# Altium project PCB__HMI3D.PrjPCB
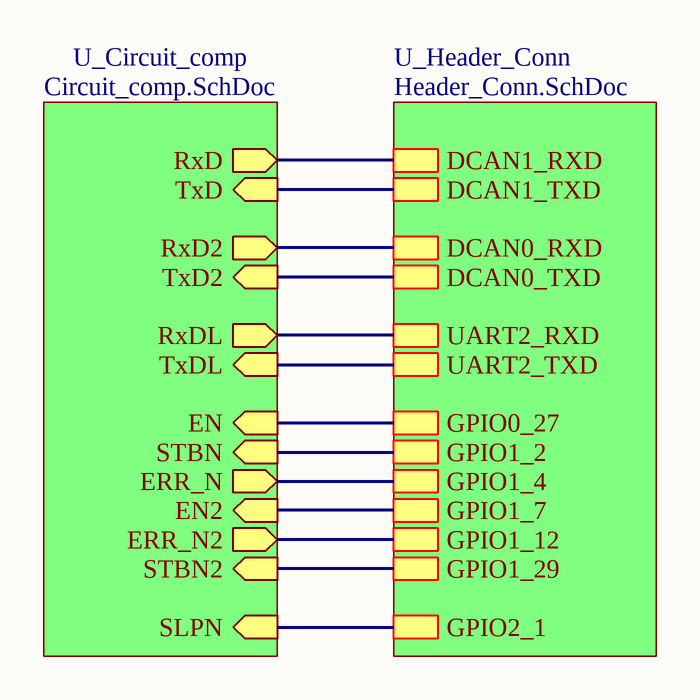
[diagram p0: Circuit.SchDoc]
7 sheets, 42 parts. Net scope: hierarchical (ports join the sheet entries above them; power ports are global).
Board file: Circuit.PcbDoc
Sheets:
  Circuit.SchDoc
    U_Circuit_comp = Circuit_comp.SchDoc
      U_Power_Sources = Power_Sources.SchDoc
        U_EMI_Prot_1 = EMI_Prot.SchDoc
        U_EMI_Prot_2 = EMI_Prot.SchDoc
      CAN2 = CAN2.SchDoc
        U_EMI_Prot_Circ = EMI_Prot_Circ.SchDoc
    U_Header_Conn = Header_Conn.SchDoc

## Sheet Circuit.SchDoc
size A4

### Sub-sheets
U_Circuit_comp = Circuit_comp.SchDoc: STBN2 (in), EN2 (in), TxD2 (in), ERR_N2 (out), RxD2 (out), RxDL (out), TxDL (in), SLPN (in), ERR_N (out), RxD (out), STBN (in), EN (in), TxD (in)
U_Header_Conn = Header_Conn.SchDoc: GPIO1_2, GPIO0_27, GPIO1_7, GPIO1_12, GPIO1_29, DCAN0_RXD, UART2_TXD, DCAN0_TXD, UART2_RXD, DCAN1_RXD, DCAN1_TXD, GPIO1_4, GPIO2_1

### Nets
GPIO0_27: sheet U_Circuit_comp/EN, sheet U_Header_Conn/GPIO0_27
GPIO1_12: sheet U_Circuit_comp/ERR_N2, sheet U_Header_Conn/GPIO1_12
GPIO1_29: sheet U_Circuit_comp/STBN2, sheet U_Header_Conn/GPIO1_29
GPIO2_1: sheet U_Circuit_comp/SLPN, sheet U_Header_Conn/GPIO2_1
I2C2_SCL: sheet U_Circuit_comp/RxD2, sheet U_Header_Conn/DCAN0_RXD
I2C2_SDA: sheet U_Circuit_comp/TxD2, sheet U_Header_Conn/DCAN0_TXD
MMC1_DAT2: sheet U_Circuit_comp/STBN, sheet U_Header_Conn/GPIO1_2
MMC1_DAT4: sheet U_Circuit_comp/ERR_N, sheet U_Header_Conn/GPIO1_4
MMC1_DAT7: sheet U_Circuit_comp/EN2, sheet U_Header_Conn/GPIO1_7
UART1_RXD: sheet U_Circuit_comp/TxD, sheet U_Header_Conn/DCAN1_TXD
UART1_TXD: sheet U_Circuit_comp/RxD, sheet U_Header_Conn/DCAN1_RXD
UART2_RXD: sheet U_Circuit_comp/RxDL, sheet U_Header_Conn/UART2_RXD
UART2_TXD: sheet U_Circuit_comp/TxDL, sheet U_Header_Conn/UART2_TXD

## Sheet Circuit_comp.SchDoc
size A4
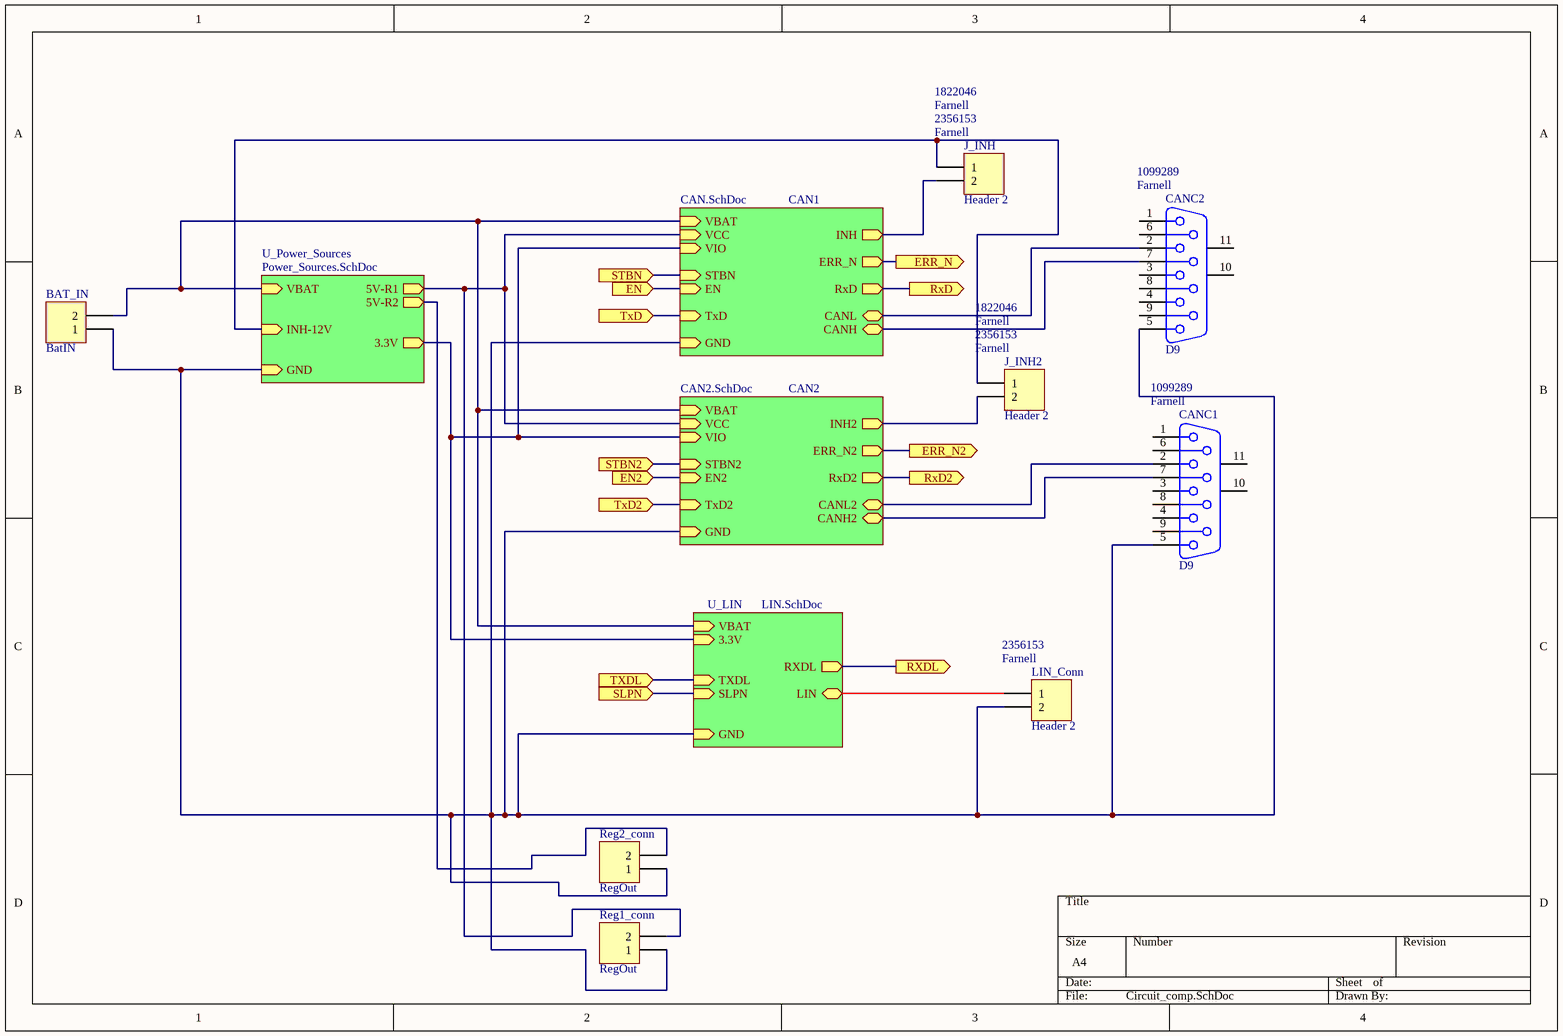
[diagram p1: Circuit_comp.SchDoc]

### Parts
BAT_IN  BatIN  [HDR1X2]
CANC1  D9  Supplier 1: Farnell  Supplier Part Number 1: 1099289  [DSUB1.385-2H9]
CANC2  D9  Supplier 1: Farnell  Supplier Part Number 1: 1099289  [DSUB1.385-2H9]
J_INH  Header 2  Supplier 1: Farnell  Supplier Part Number 1: 2356153  Supplier Part Number 2: 1822046  [HDR1X2]
J_INH2  Header 2  Supplier 1: Farnell  Supplier Part Number 1: 2356153  Supplier Part Number 2: 1822046  [HDR1X2]
LIN_Conn  Header 2  Supplier 1: Farnell  Supplier Part Number 1: 2356153  [HDR1X2]
Reg1_conn  RegOut  [HDR1X2]
Reg2_conn  RegOut  [HDR1X2]

### Sub-sheets
CAN1 = CAN.SchDoc (file not in this document): VCC (in), VIO (in), GND (in), INH (out), CANH (bidir), CANL (bidir), STBN (in), EN (in), ERR_N (out), TxD (in), RxD (out), VBAT (in)
CAN2 = CAN2.SchDoc: VCC (in), VIO (in), GND (in), INH2 (out), CANH2 (bidir), CANL2 (bidir), STBN2 (in), EN2 (in), ERR_N2 (out), TxD2 (in), RxD2 (out), VBAT (in)
U_LIN = LIN.SchDoc (file not in this document): VBAT (in), LIN (bidir), SLPN (in), RXDL (out), TXDL (in), GND (in), 3.3V (in)
U_Power_Sources = Power_Sources.SchDoc: VBAT (in), GND (in), INH-12V (in), 5V-R1 (out), 5V-R2 (out), 3.3V (out)

### Ports
EN2 (in), EN (in), ERR_N2 (out), ERR_N (out), RxD2 (out), RxD (out), RXDL (out), SLPN (in), STBN2 (in), STBN (in), TxD2 (in), TxD (in), TXDL (in)

### Nets
GND: BAT_IN.1 CANC1.5 CANC2.5 LIN_Conn.2 Reg1_conn.1 Reg2_conn.1 ; sheet CAN1/GND, sheet U_LIN/GND, sheet U_Power_Sources/GND, sheet CAN2/GND
GPIO0_27: port EN, sheet CAN1/EN
GPIO1_12: port ERR_N2, sheet CAN2/ERR_N2
GPIO1_29: port STBN2, sheet CAN2/STBN2
GPIO2_1: port SLPN, sheet U_LIN/SLPN
I2C2_SCL: port RxD2, sheet CAN2/RxD2
I2C2_SDA: port TxD2, sheet CAN2/TxD2
MMC1_DAT2: port STBN, sheet CAN1/STBN
MMC1_DAT4: port ERR_N, sheet CAN1/ERR_N
MMC1_DAT7: port EN2, sheet CAN2/EN2
UART1_RXD: port TxD, sheet CAN1/TxD
UART1_TXD: port RxD, sheet CAN1/RxD
UART2_RXD: port RXDL, sheet U_LIN/RXDL
UART2_TXD: port TXDL, sheet U_LIN/TXDL
NetBAT_IN_2: BAT_IN.2 ; sheet CAN1/VBAT, sheet U_LIN/VBAT, sheet U_Power_Sources/VBAT, sheet CAN2/VBAT
NetC22_2: Reg1_conn.2 ; sheet CAN1/VCC, sheet U_Power_Sources/5V-R1, sheet CAN2/VCC
NetC25_2: CANC1.7 ; sheet CAN2/CANH2
NetC26_2: CANC1.2 ; sheet CAN2/CANL2
NetC32_2: sheet CAN1/VIO, sheet U_LIN/3.3V, sheet U_Power_Sources/3.3V, sheet CAN2/VIO
NetCANC2_2: CANC2.2 ; sheet CAN1/CANL
NetCANC2_7: CANC2.7 ; sheet CAN1/CANH
NetJ_INH2_2: J_INH2.2 ; sheet CAN2/INH2
NetJ_INH_1: J_INH.1 J_INH2.1 ; sheet U_Power_Sources/INH-12V
NetJ_INH_2: J_INH.2 ; sheet CAN1/INH
NetLIN_Conn_1: LIN_Conn.1 ; sheet U_LIN/LIN
NetR34_1: Reg2_conn.2 ; sheet U_Power_Sources/5V-R2

Not connected (* = marked no-connect by the designer): CANC1 1 3 4 6 8 9 10(MH1) 11(MH2); CANC2 1 3 4 6 8 9 10(MH1) 11(MH2)

### Library data of the parts
BAT_IN J_INH J_INH2 LIN_Conn Reg1_conn Reg2_conn = Header 2: Header, 2-Pin; LatestRevisionDate: 17-Jul-2002; LatestRevisionNote: Re-released for DXP Platform.; Publisher: Altium Limited
  BAT_IN: Supplier Part Number 1: 612-0150; Supplier 1: RS
  J_INH J_INH2: Supplier 2: Farnell
CANC1 CANC2 = D Connector 9: Receptacle Assembly, 9 Position, Right Angle; PackageDocument: O; Positions: 9; Published: 15-Jun-2001; LatestRevisionDate: 17-Jul-2002; LatestRevisionNote: Re-released for DXP Platform.; DatasheetDocument: 1-Sep-1999; PackageReference: 788750; Publisher: Altium Limited; Orientation: Right Angle; Gender: Receptacle

## Sheet Power_Sources.SchDoc
size A4
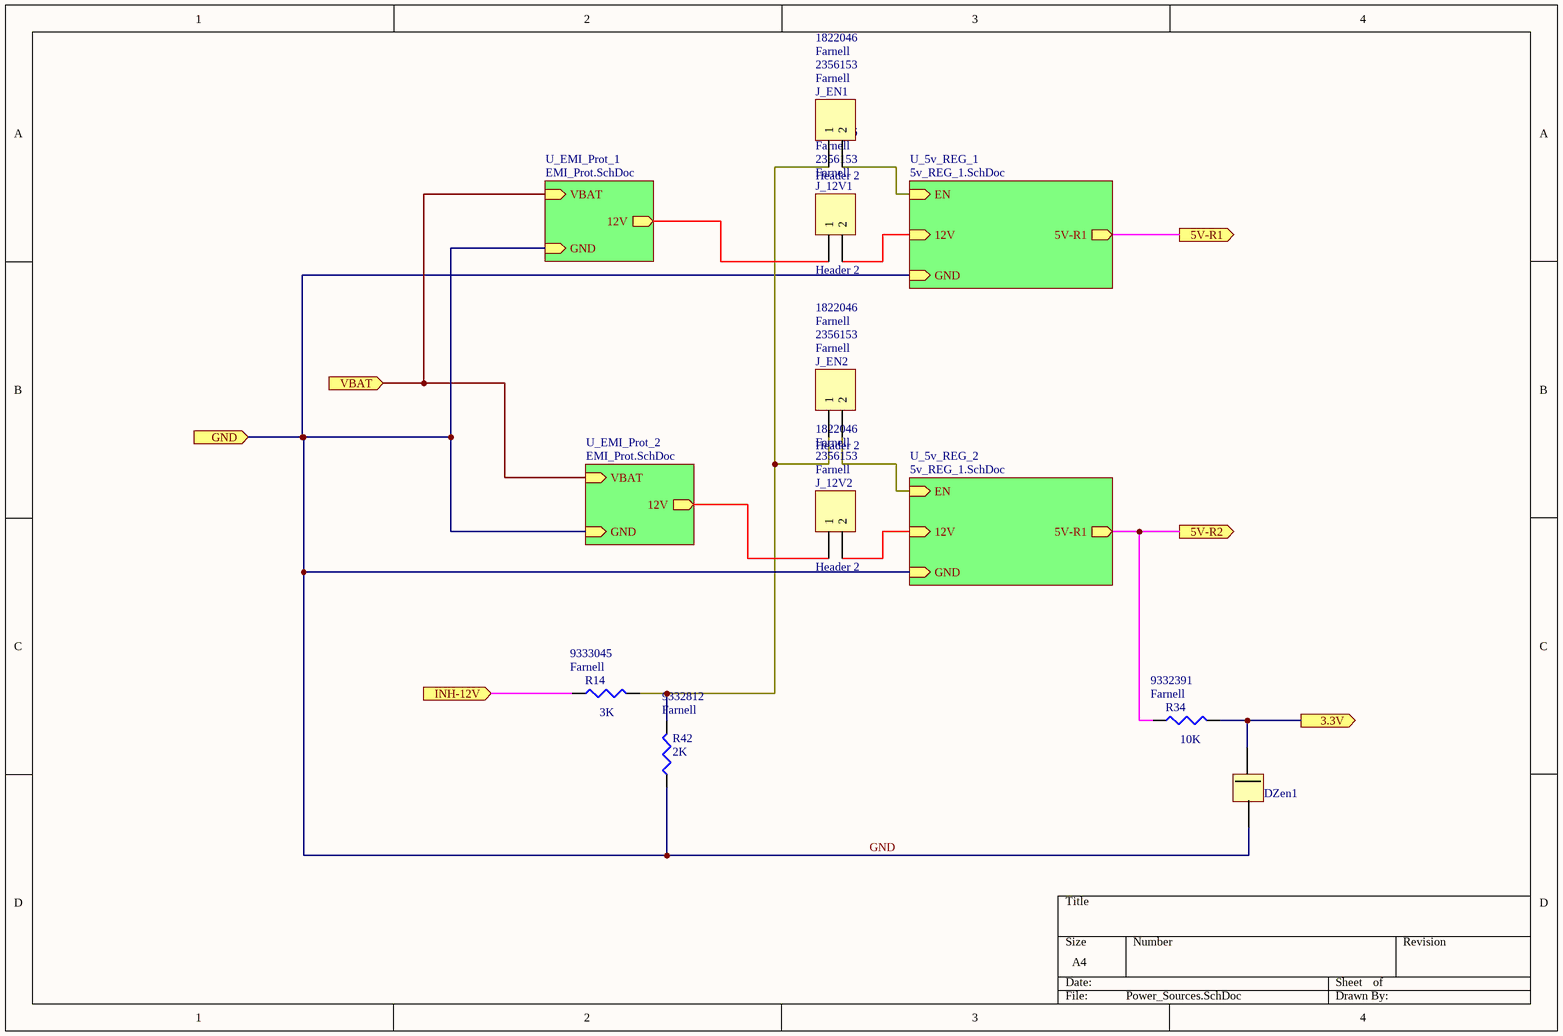
[diagram p2: Power_Sources.SchDoc]

### Parts
DZen1  3.3V  [Zener_Diode]  (value not drawn)
J_12V1  Header 2  Supplier 1: Farnell  Supplier Part Number 1: 2356153  Supplier Part Number 2: 1822046  [HDR1X2]
J_12V2  Header 2  Supplier 1: Farnell  Supplier Part Number 1: 2356153  Supplier Part Number 2: 1822046  [HDR1X2]
J_EN1  Header 2  Supplier 1: Farnell  Supplier Part Number 1: 2356153  Supplier Part Number 2: 1822046  [HDR1X2]
J_EN2  Header 2  Supplier 1: Farnell  Supplier Part Number 1: 2356153  Supplier Part Number 2: 1822046  [HDR1X2]
R14  Supplier 1: Farnell  Supplier Part Number 1: 9333045  [RES_0805]  (hidden comment: 3K)
R34  Supplier 1: Farnell  Supplier Part Number 1: 9332391  [RES_0805]  (hidden comment: 10K)
R42  Supplier 1: Farnell  Supplier Part Number 1: 9332812  [RES_0805]  (hidden comment: 2K)

### Sub-sheets
U_5v_REG_1 = 5v_REG_1.SchDoc (file not in this document): 12V (in), GND (in), EN (in), 5V-R1 (out)
U_5v_REG_2 = 5v_REG_1.SchDoc (file not in this document): 12V (in), GND (in), EN (in), 5V-R1 (out)
U_EMI_Prot_1 = EMI_Prot.SchDoc: VBAT (in), GND (in), 12V (out)
U_EMI_Prot_2 = EMI_Prot.SchDoc: VBAT (in), GND (in), 12V (out)

### Ports
3.3V (out), 5V-R1 (out), 5V-R2 (out), GND (in), INH-12V (in), VBAT (in)

### Nets
GND: DZen1.D2 R42.1 ; port GND, sheet U_5v_REG_1/GND, sheet U_5v_REG_2/GND, sheet U_EMI_Prot_1/GND, sheet U_EMI_Prot_2/GND
NetBAT_IN_2: port VBAT, sheet U_EMI_Prot_1/VBAT, sheet U_EMI_Prot_2/VBAT
NetC22_2: port 5V-R1, sheet U_5v_REG_1/5V-R1
NetC32_2: DZen1.D1 R34.2 ; port 3.3V
NetJ_12V1_1: J_12V1.1 ; sheet U_EMI_Prot_1/12V
NetJ_12V1_2: J_12V1.2 ; sheet U_5v_REG_1/12V
NetJ_12V2_1: J_12V2.1 ; sheet U_EMI_Prot_2/12V
NetJ_12V2_2: J_12V2.2 ; sheet U_5v_REG_2/12V
NetJ_EN1_1: J_EN1.1 J_EN2.1 R14.2 R42.2
NetJ_EN1_2: J_EN1.2 ; sheet U_5v_REG_1/EN
NetJ_EN2_2: J_EN2.2 ; sheet U_5v_REG_2/EN
NetJ_INH_1: R14.1 ; port INH-12V
NetR34_1: R34.1 ; port 5V-R2, sheet U_5v_REG_2/5V-R1

### Library data of the parts
DZen1 = D_Zener: Zener Diode 3.3V; Supplier Part Number 1: 621-BZT52HC3V3WF-7; Supplier 1: Mouser; HelpURL: http://www.mouser.com/ds/2/115/BZT52HC2V4WF%20-%20BZT52HC47WF-948206.pdf
J_12V1 J_12V2 J_EN1 J_EN2 = Header 2: Header, 2-Pin; LatestRevisionDate: 17-Jul-2002; LatestRevisionNote: Re-released for DXP Platform.; Publisher: Altium Limited; Supplier 2: Farnell
R14 R34 R42 = Res3: Resistor; Published: 8-Jun-2000; LatestRevisionDate: 29-May-2009; LatestRevisionNote: IPC-7351 Footprint Added.; PackageReference: J1-0603; Publisher: Altium Limited; PackageDescription: Chip Resistor
  R14: Value: 3K
  R34: Value: 10K
  R42: Value: 2K

## Sheet EMI_Prot.SchDoc
size A4
Used 2 times, as channels U_Circuit_comp/U_Power_Sources/U_EMI_Prot_1, U_Circuit_comp/U_Power_Sources/U_EMI_Prot_2. Parts and nets are listed once, with the designators drawn on the sheet.
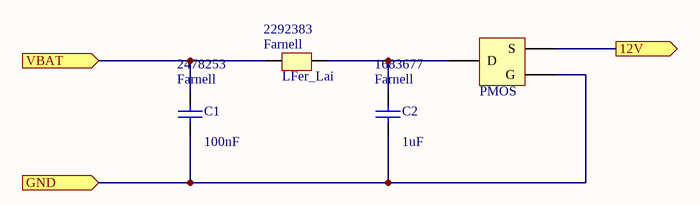
[diagram p3: EMI_Prot.SchDoc]

### Parts
C1  value 100nF  Supplier 1: Farnell  Supplier Part Number 1: 2478253  [CAP_0805]  (hidden comment: 100n)
C2  value 1uF  Supplier 1: Farnell  Supplier Part Number 1: 1683677  [CAP_0805]  (hidden comment: 1u)
LFer_Lai  Supplier 1: Farnell  Supplier Part Number 1: 2292383  [LFerrite_Laird]
PMOS  (no value)  [PMOS]

### Ports
12V (out), GND (in), VBAT (in)

### Nets
12V: PMOS.S ; port 12V
GND: C1.2 C2.2 PMOS.G ; port GND
VBAT: C1.1 LFer_Lai.1 ; port VBAT
NetC2_1: C2.1 LFer_Lai.2 PMOS.D

### Channels
U_Circuit_comp/U_Power_Sources/U_EMI_Prot_1: designators C1=C1#1 C2=C2#1 LFer_Lai=LFer_L#1 PMOS=PMOS#1; ports 12V=NetJ_12V1_1 GND=GND VBAT=NetBAT_IN_2
U_Circuit_comp/U_Power_Sources/U_EMI_Prot_2: designators C1=C1#2 C2=C2#2 LFer_Lai=LFer_L#2 PMOS=PMOS#2; ports 12V=NetJ_12V2_1 GND=GND VBAT=NetBAT_IN_2

### Library data of the parts
C1 C2 = Cap Semi: Capacitor; Published: 8-Jun-2000; LatestRevisionDate: 29-May-2009; LatestRevisionNote: IPC-7351 Footprint Added.; PackageReference: C1206; Publisher: Altium Limited; PackageDescription: Chip Capacitor
LFer_Lai = LFerrite_Laird: Laird ferrite chip bead; HelpURL: http://www.farnell.com/datasheets/1685731.pdf?_ga=1.185171822.65109063.1469090403
PMOS = PMOS: P channel Mosfet; HelpURL: http://www.mouser.com/ds/2/115/DMP6180SK3-247239.pdf

## Sheet CAN2.SchDoc
size A4
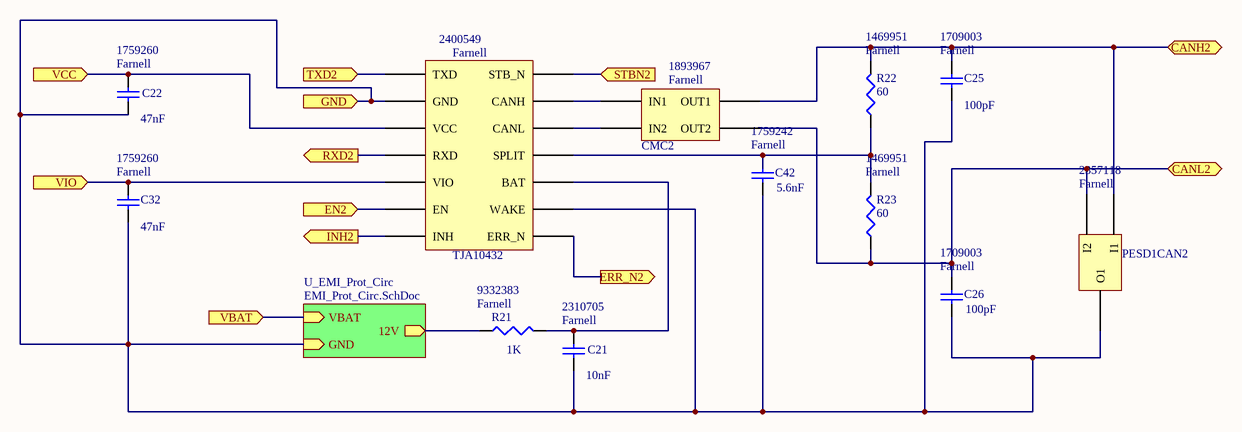
[diagram p4: CAN2.SchDoc]

### Parts
C21  value 10nF  Supplier 1: Farnell  Supplier Part Number 1: 2310705  [CAP_0805]  (hidden comment: 10n)
C22  value 47nF  Supplier 1: Farnell  Supplier Part Number 1: 1759260  [CAP_0805]  (hidden comment: 47n)
C25  value 100pF  Supplier 1: Farnell  Supplier Part Number 1: 1709003  [CAP_0805]  (hidden comment: 100p)
C26  value 100pF  Supplier 1: Farnell  Supplier Part Number 1: 1709003  [CAP_0805]  (hidden comment: 100p)
C32  value 47nF  Supplier 1: Farnell  Supplier Part Number 1: 1759260  [CAP_0805]  (hidden comment: 47n)
C42  value 5.6nF  Supplier 1: Farnell  Supplier Part Number 1: 1759242  [CAP_0805]  (hidden comment: 5.6n)
CMC2  Supplier 1: Farnell  Supplier Part Number 1: 1893967  [CMC]
PESD1CAN2  Supplier 1: Farnell  Supplier Part Number 1: 2357118  [SOT32-PESD1CAN]
R21  Supplier 1: Farnell  Supplier Part Number 1: 9332383  [RES_0805]  (hidden comment: 1k)
R22  Supplier 1: Farnell  Supplier Part Number 1: 1469951  [RES_0805]  (hidden comment: 60)
R23  Supplier 1: Farnell  Supplier Part Number 1: 1469951  [RES_0805]  (hidden comment: 60)
TJA10432  Supplier 1: Farnell  Supplier Part Number 1: 2400549  [SOIC14-TJA1043]

### Sub-sheets
U_EMI_Prot_Circ = EMI_Prot_Circ.SchDoc: VBAT (in), GND (in), 12V (out)

### Ports
CANH2 (bidir), CANL2 (bidir), EN2 (in), ERR_N2 (out), GND (in), INH2 (out), RXD2 (out), STBN2 (in), TXD2 (in), VBAT (in), VCC (in), VIO (in)

### Nets
GND: C21.1 C22.1 C25.1 C26.1 C32.1 C42.1 PESD1CAN2.O1 TJA10432.GND TJA10432.WAKE ; port GND, sheet U_EMI_Prot_Circ/GND
GPIO1_12: TJA10432.ERR_N ; port ERR_N2
GPIO1_29: TJA10432.STB_N ; port STBN2
I2C2_SCL: TJA10432.RXD ; port RXD2
I2C2_SDA: TJA10432.TXD ; port TXD2
MMC1_DAT7: TJA10432.EN ; port EN2
NetBAT_IN_2: port VBAT, sheet U_EMI_Prot_Circ/VBAT
NetC21_2: C21.2 R21.2 TJA10432.BAT
NetC22_2: C22.2 TJA10432.VCC ; port VCC
NetC25_2: C25.2 CMC2.OUT1 PESD1CAN2.I1 R22.2 ; port CANH2
NetC26_2: C26.2 CMC2.OUT2 PESD1CAN2.I2 R23.1 ; port CANL2
NetC32_2: C32.2 TJA10432.VIO ; port VIO
NetC42_2: C42.2 R22.1 R23.2 TJA10432.SPLIT
NetCMC2_IN1: CMC2.IN1 TJA10432.CANH
NetCMC2_IN2: CMC2.IN2 TJA10432.CANL
NetJ_INH2_2: TJA10432.INH ; port INH2
NetPMOS#3_S: R21.1 ; sheet U_EMI_Prot_Circ/12V

### Library data of the parts
C21 C22 C25 C26 C32 C42 = Cap Semi: Capacitor; Published: 8-Jun-2000; LatestRevisionDate: 29-May-2009; LatestRevisionNote: IPC-7351 Footprint Added.; PackageReference: C1206; Publisher: Altium Limited; PackageDescription: Chip Capacitor
CMC2 = Common_Mode_Choke: Common mode choke: DR331-475BE; HelpURL: http://www.mouser.com/ds/2/54/R331-777616.pdf
PESD1CAN2 = PESD1CAN: CAN bus ESD protection diode
R21-R23 = Res3: Resistor; Published: 8-Jun-2000; LatestRevisionDate: 29-May-2009; LatestRevisionNote: IPC-7351 Footprint Added.; PackageReference: J1-0603; Publisher: Altium Limited; PackageDescription: Chip Resistor
  R21: Value: 1K
  R22 R23: Value: 60
TJA10432 = TJA1043: CAN transceiver; Models: TJA10432; HelpURL: http://www.nxp.com/documents/data_sheet/TJA1043.pdf

## Sheet EMI_Prot_Circ.SchDoc
size A4
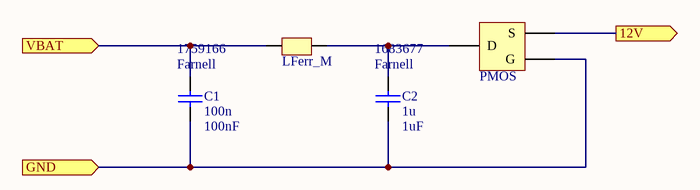
[diagram p5: EMI_Prot_Circ.SchDoc]

### Parts
(Parts that share a designator on the sheet are numbered #1, #2 ... from top to bottom, then left to right.)
C1#3  100n  value 100nF  Supplier 1: Farnell  Supplier Part Number 1: 1759166  [CAP_0805]
C2#3  1u  value 1uF  Supplier 1: Farnell  Supplier Part Number 1: 1683677  [CAP_0805]
LFerr_M  (no value)  [LFERRITE_MURATA_BLM21A]
PMOS#3  (no value)  [PMOS]

### Ports
12V (out), GND (in), VBAT (in)

### Nets
GND: C1#3.2 C2#3.2 PMOS#3.G ; port GND
NetBAT_IN_2: C1#3.1 LFerr_M.1 ; port VBAT
NetC2#3_1: C2#3.1 LFerr_M.2 PMOS#3.D
NetPMOS#3_S: PMOS#3.S ; port 12V

### Library data of the parts
C1#3 C2#3 = Cap Semi: Capacitor; Published: 8-Jun-2000; LatestRevisionDate: 29-May-2009; LatestRevisionNote: IPC-7351 Footprint Added.; PackageReference: C1206; Publisher: Altium Limited; PackageDescription: Chip Capacitor
LFerr_M = LFerrite_Murata: Murata ferrite chip bead - BLE32PN300SN1L; Impedance: 30ohm; MAX DC CUR: 10A; HelpURL: http://www.mouser.com/ds/2/281/c31e-522703.pdf; Supplier Part Number 1: 81-BLE32PN300SN1L; Supplier 1: Mouser
PMOS#3 = PMOS: P channel Mosfet; HelpURL: http://www.mouser.com/ds/2/115/DMP6180SK3-247239.pdf; Supplier 1: Mouser; Supplier Part Number 1: 621-DMP6180SK3-13

## Sheet Header_Conn.SchDoc
size A4
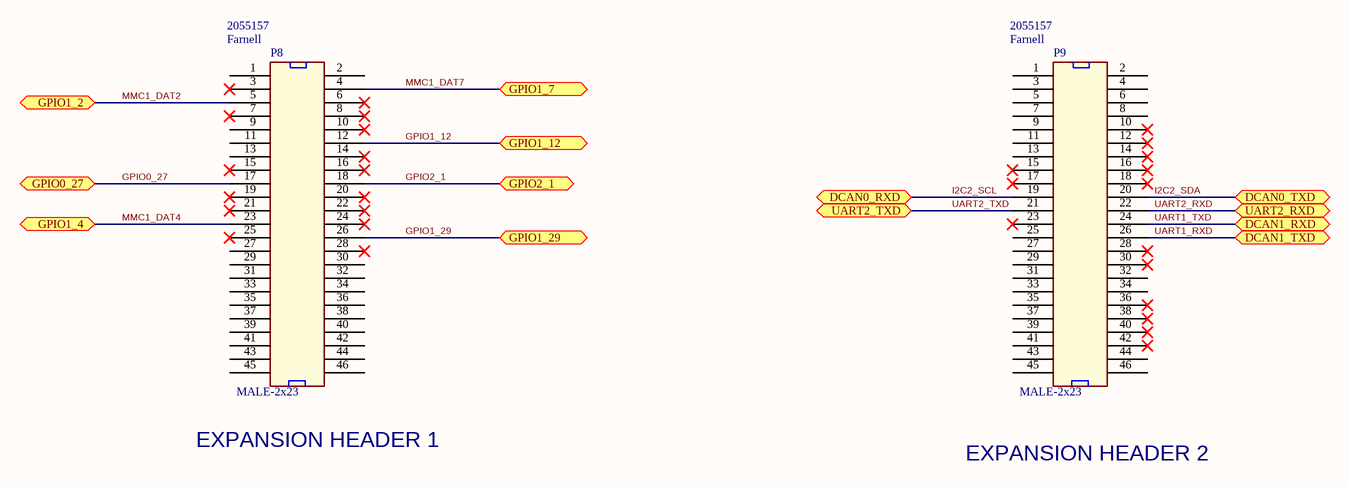
[diagram p6: Header_Conn.SchDoc]

### Parts
P8  MALE-2x23  Supplier 1: Farnell  Supplier Part Number 1: 2055157  [Beagle_Header]
P9  MALE-2x23  Supplier 1: Farnell  Supplier Part Number 1: 2055157  [Beagle_Header]

### Ports
DCAN0_RXD, DCAN0_TXD, DCAN1_RXD, DCAN1_TXD, GPIO0_27, GPIO1_2, GPIO1_4, GPIO1_7, GPIO1_12, GPIO1_29, GPIO2_1, UART2_RXD, UART2_TXD

### Nets
GPIO0_27: P8.17 ; port GPIO0_27
GPIO1_12: P8.12 ; port GPIO1_12
GPIO1_29: P8.26 ; port GPIO1_29
GPIO2_1: P8.18 ; port GPIO2_1
I2C2_SCL: P9.19 ; port DCAN0_RXD
I2C2_SDA: P9.20 ; port DCAN0_TXD
MMC1_DAT2: P8.5 ; port GPIO1_2
MMC1_DAT4: P8.23 ; port GPIO1_4
MMC1_DAT7: P8.4 ; port GPIO1_7
UART1_RXD: P9.26 ; port DCAN1_TXD
UART1_TXD: P9.24 ; port DCAN1_RXD
UART2_RXD: P9.22 ; port UART2_RXD
UART2_TXD: P9.21 ; port UART2_TXD

Not connected (* = marked no-connect by the designer): P8 1 2(26) 3(2)* 6(28)* 7(4)* 8(29)* 9(5) 10(30)* 11(6) 13(7) 14(32)* 15(8)* 16(33)* 19(10)* 20(35)* 21(11)* 22(36)* 24(37)* 25(13)* 27(14) 28(39)* 29(15) 30(40) 31(16) 32(41) 33(17) 34(42) 35(18) 36(43) 37(19) 38(44) 39(20) 40(45) 41(21) 42(46) 43(22) 44(47) 45(23) 46(48); P9 1 2(26) 3(2) 4(27) 5(3) 6(28) 7(4) 8(29) 9(5) 10(30)* 11(6) 12(31)* 13(7) 14(32)* 15(8)* 16(33)* 17(9)* 18(34)* 23(12)* 25(13) 27(14) 28(39)* 29(15) 30(40)* 31(16) 32(41) 33(17) 34(42) 35(18) 36(43)* 37(19) 38(44)* 39(20) 40(45)* 41(21) 42(46)* 43(22) 44(47) 45(23) 46(48)

### Notes on the sheet
- EXPANSION HEADER 1
- EXPANSION HEADER 2

### Library data of the parts
P8 P9 = BHead: MALE HEADER 2x23

## Nets that join several sheets
GND: Circuit_comp (6 pins), Power_Sources (DZen1.D2 R42.1), U_Circuit_comp/U_Power_Sources/U_EMI_Prot_1 (C1#1.2 C2#1.2 PMOS#1.G), U_Circuit_comp/U_Power_Sources/U_EMI_Prot_2 (C1#2.2 C2#2.2 PMOS#2.G), CAN2 (9 pins), EMI_Prot_Circ (C1#3.2 C2#3.2 PMOS#3.G)
GPIO1_12: CAN2 (TJA10432.ERR_N), Header_Conn (P8.12)
GPIO1_29: CAN2 (TJA10432.STB_N), Header_Conn (P8.26)
I2C2_SCL: CAN2 (TJA10432.RXD), Header_Conn (P9.19)
I2C2_SDA: CAN2 (TJA10432.TXD), Header_Conn (P9.20)
MMC1_DAT7: CAN2 (TJA10432.EN), Header_Conn (P8.4)
NetBAT_IN_2: Circuit_comp (BAT_IN.2), U_Circuit_comp/U_Power_Sources/U_EMI_Prot_1 (C1#1.1 LFer_L#1.1), U_Circuit_comp/U_Power_Sources/U_EMI_Prot_2 (C1#2.1 LFer_L#2.1), EMI_Prot_Circ (C1#3.1 LFerr_M.1)
NetC22_2: Circuit_comp (Reg1_conn.2), CAN2 (C22.2 TJA10432.VCC)
NetC25_2: Circuit_comp (CANC1.7), CAN2 (C25.2 CMC2.OUT1 PESD1CAN2.I1 R22.2)
NetC26_2: Circuit_comp (CANC1.2), CAN2 (C26.2 CMC2.OUT2 PESD1CAN2.I2 R23.1)
NetC32_2: Power_Sources (DZen1.D1 R34.2), CAN2 (C32.2 TJA10432.VIO)
NetJ_12V1_1: Power_Sources (J_12V1.1), U_Circuit_comp/U_Power_Sources/U_EMI_Prot_1 (PMOS#1.S)
NetJ_12V2_1: Power_Sources (J_12V2.1), U_Circuit_comp/U_Power_Sources/U_EMI_Prot_2 (PMOS#2.S)
NetJ_INH2_2: Circuit_comp (J_INH2.2), CAN2 (TJA10432.INH)
NetJ_INH_1: Circuit_comp (J_INH.1 J_INH2.1), Power_Sources (R14.1)
NetPMOS#3_S: CAN2 (R21.1), EMI_Prot_Circ (PMOS#3.S)
NetR34_1: Circuit_comp (Reg2_conn.2), Power_Sources (R34.1)